# EAGLE design jnz-rev3 (EAGLE 7.6.0)
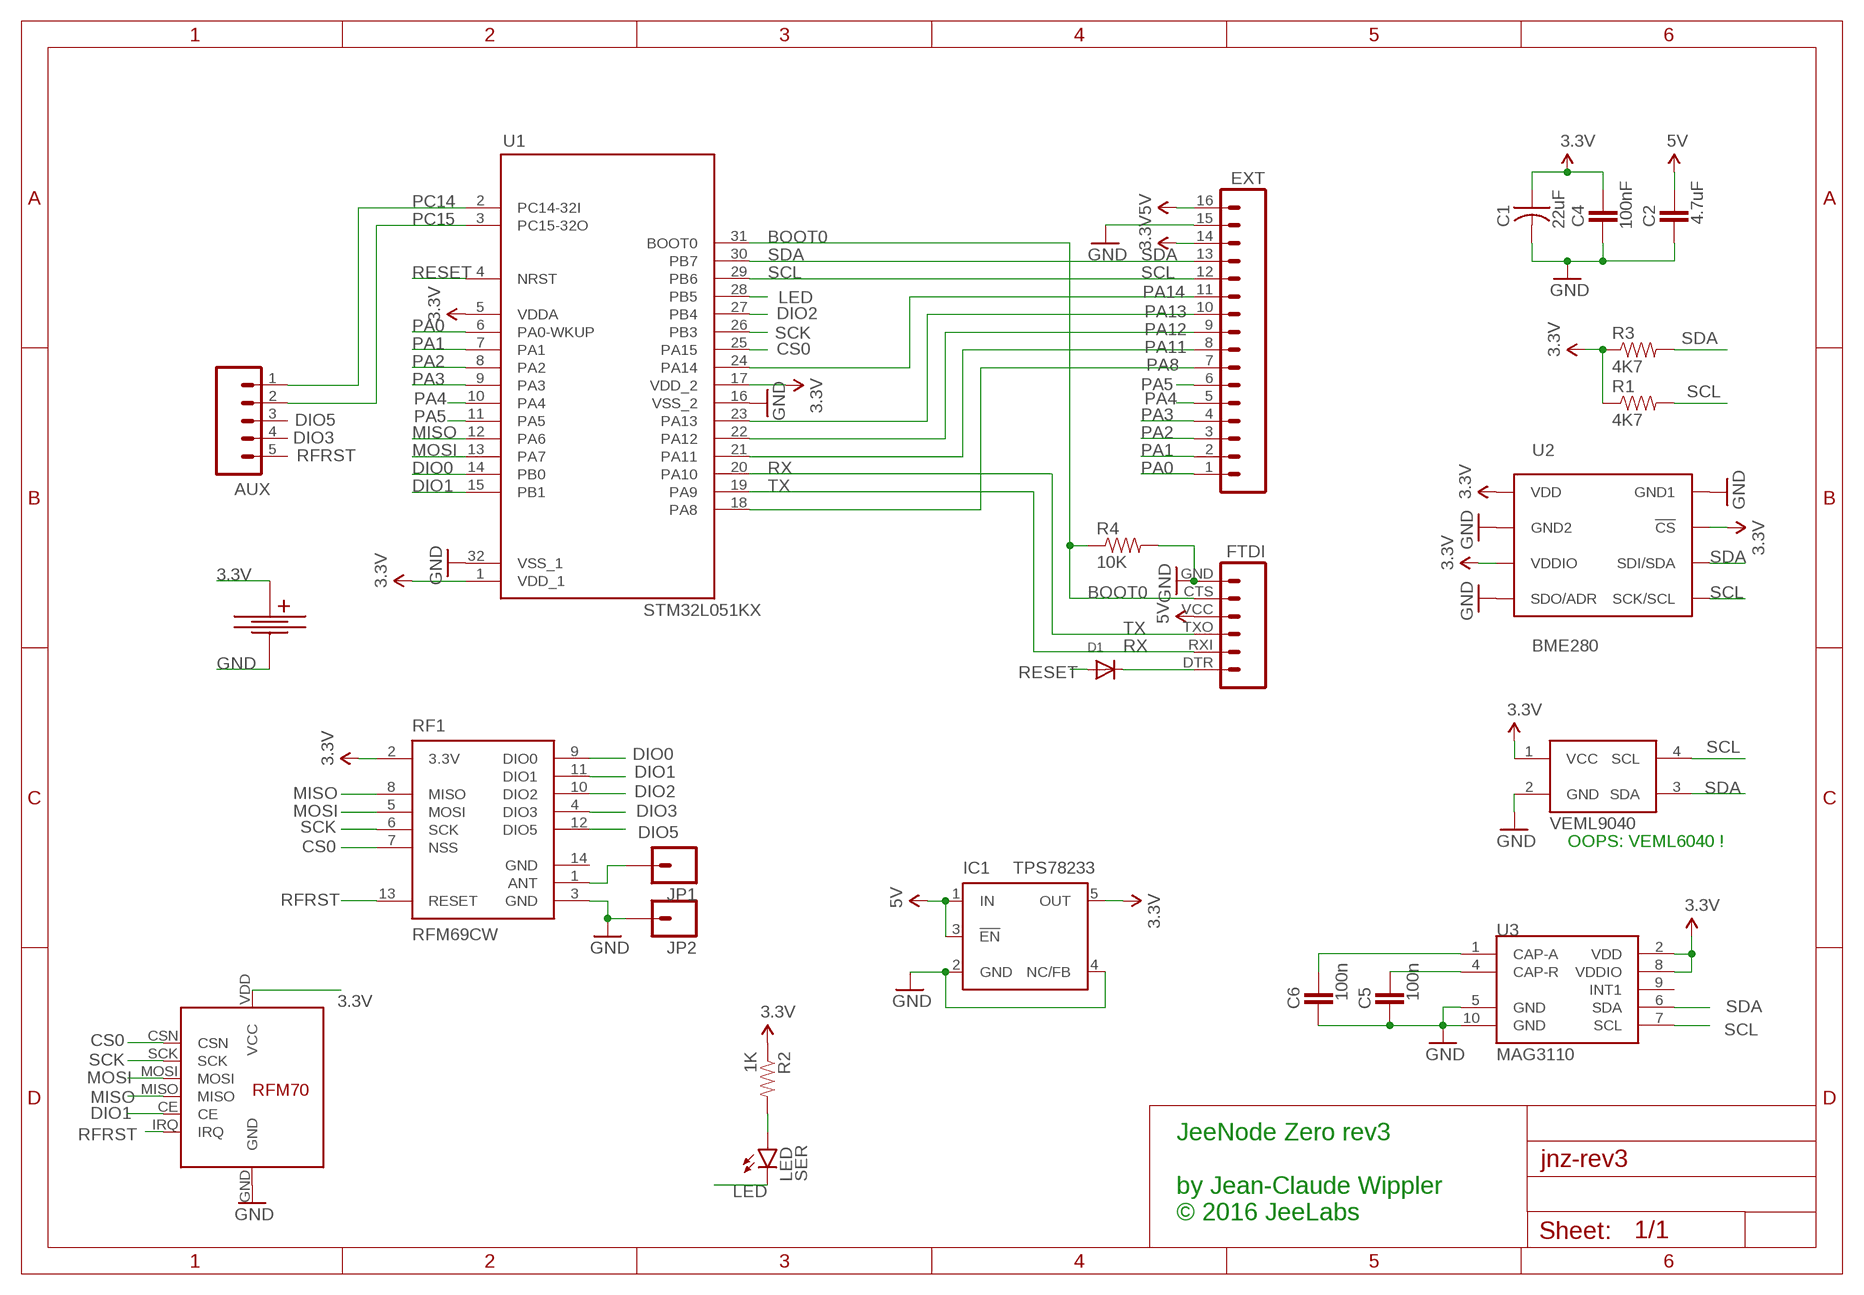
[diagram p0: schematic, sheet 1]

## Parts
AUX  M05NO_SILK  [1X05_NO_SILK]
C1  22uF  C-USC0805  [C0805]
C2  4.7uF  C-EUC0805K  [C0805K]
C4  100nF  C-EUC0603K  [C0603K]
C5  100n  C-EUC0603K  [C0603K]
C6  100n  C-EUC0603K  [C0603K]
D1  DIODESOD-323F  [SOD-323F]
EXT  M161X16_NO_SILK  [1X16_NO_SILK]
FTDI  FTDI_BASICPTH  [FTDI_BASIC]
IC1  TPS78233  TPS77001  [SOT23-DBV]
JP1  M01NOSILK-KIT  [1X01NS-KIT]
JP2  M01NOSILK-KIT  [1X01NS-KIT]
LED  SER  LED0603  [LED-0603]
R1  4K7  RESISTOR0603-RES  [0603-RES]
R2  1K  RESISTOR0603-RES  [0603-RES]
R3  4K7  RESISTOR0603-RES  [0603-RES]
R4  10K  RESISTOR0603-RES  [0603-RES]
RF1  RFM69CW  [RFM69CW-XXXS2]
RF2  RFM7x  RFM70  [RFM70]
U1  STM32L051KX  [TQFP32-08]
U2  BME280  [BME280_LGA]
U3  MAG3110  [DFN-10]
U$2  CR2032-SMD  [CR2032-SMD]
U$3  VEML6040  [OPLGA-4]

## Nets
3.3V [power]: C1.1 C4.1 EXT.14 IC1.5(OUT) R1.1 R2.1 R3.1 RF1.2(3.3V) RF2.VDD(VCC) U1.1(VDD_1) U1.5(VDDA) U1.17(VDD_2) U2.P$2(!CS) U2.P$6(VDDIO) U2.P$8(VDD) U3.2(VDD) U3.8(VDDIO) U$2.POS(+) U$3.1(VCC)
5V [power]: C2.1 EXT.16 FTDI.VCC IC1.1(IN) IC1.3(!EN)
BOOT0: FTDI.CTS R4.1 U1.31(BOOT0)
CS0: RF1.7(NSS) RF2.CSN U1.25(PA15)
DIO0: RF1.9(DIO0) U1.14(PB0)
DIO1: RF1.11(DIO1) RF2.CE U1.15(PB1)
DIO2: RF1.10(DIO2) U1.27(PB4)
DIO3: AUX.4 RF1.4(DIO3)
DIO5: AUX.3 RF1.12(DIO5)
GND: C1.2 C2.2 C4.2 C5.2 C6.2 EXT.15 FTDI.GND IC1.2(GND) IC1.4(NC/FB) JP2.1 R4.2 RF1.3(GND) RF2.GND U1.16(VSS_2) U1.32(VSS_1) U2.P$1(GND1) U2.P$5(SDO/ADR) U2.P$7(GND2) U3.5(GND) U3.10(GND) U$2.NEG(-) U$3.2(GND)
LED: LED.C U1.28(PB5)
MISO: RF1.8(MISO) RF2.MISO U1.12(PA6)
MOSI: RF1.5(MOSI) RF2.MOSI U1.13(PA7)
N$1: D1.C FTDI.DTR
N$2: LED.A R2.2
N$4: C5.1 U3.4(CAP-R)
N$5: C6.1 U3.1(CAP-A)
N$13: JP1.1 RF1.1(ANT)
PA0: EXT.1 U1.6(PA0-WKUP)
PA1: EXT.2 U1.7(PA1)
PA2: EXT.3 U1.8(PA2)
PA3: EXT.4 U1.9(PA3)
PA4: EXT.5 U1.10(PA4)
PA5: EXT.6 U1.11(PA5)
PA8: EXT.7 U1.18(PA8)
PA11: EXT.8 U1.21(PA11)
PA12: EXT.9 U1.22(PA12)
PA13: EXT.10 U1.23(PA13)
PA14: EXT.11 U1.24(PA14)
PC14: AUX.1 U1.2(PC14-32I)
PC15: AUX.2 U1.3(PC15-32O)
RESET: D1.A U1.4(NRST)
RFRST: AUX.5 RF1.13(RESET) RF2.IRQ
RX: FTDI.TXO U1.20(PA10)
SCK: RF1.6(SCK) RF2.SCK U1.26(PB3)
SCL: EXT.12 R1.2 U1.29(PB6) U2.P$4(SCK/SCL) U3.7(SCL) U$3.4(SCL)
SDA: EXT.13 R3.2 U1.30(PB7) U2.P$3(SDI/SDA) U3.6(SDA) U$3.3(SDA)
TX: FTDI.RXI U1.19(PA9)
Unconnected: U3.9(INT1)

## Notes on the sheet
- OOPS: VEML6040 !
- JeeNode Zero rev3
  
  by Jean-Claude Wippler
  © 2016 JeeLabs

## Power pins joined to a net without a drawn wire
GND: RF1.14(GND)

## Library data of the parts
AUX = SparkFun-Connectors:M05: Header 5 Standard 5-pin 0.1" header. Use with straight break away headers (SKU : PRT-00116), right angle break away headers (PRT-00553), swiss pins (PRT-00743), machine pins (PRT-00117), and female headers (PRT-00115). Molex polarized connector foot print use with SKU : PRT-08230 with associated crimp pins and housings.
C1 = resistor:C-US: CAPACITOR, American symbol
C2 C4-C6 = rcl:C-EU: CAPACITOR, European symbol
D1 = adafruit:DIODE: Diode SMADIODE - SMA Surface Mount Package 20V 1A Schottky Diode Digikey: 641-1014-6-ND DO-1N4148 - Through Hole Small Current Diode SOD-123 20V 1 A (.5mV Vf) Schottky Diode - Digikey: MBRX120TPMSCT-ND SOD-323 10V 570mA (.38mV Vf, 3ns) Schottky Diode - Digikey: ZLLS410CT-ND SOD-523 30V 30mA Schottky Diode (RB751S-40TE61) - Digikey: RB751S-40TE61CT-ND SOT23-R/W - SOT23 Package (R = Solder Paste/Reflow Ovens, W = Hand-Soldering) BAT54Film 40V 300mA - Digikey: 497-7162-1-ND
EXT = SparkFun-Connectors:M16: 1x16 .1" header
FTDI = SparkFun-Connectors:FTDI_BASIC: FTDI Basic header with labels
IC1 = texas:TPS770*: ULTRALOW-POWER 50-mA LOW-DROPOUT LINEAR REGULATORS 50-mA Low-Dropout Regulator Source: http://focus.ti.com/lit/ds/symlink/tps77001.pdf; MF: TEXAS INSTRUMENTS; MPN: TPS77001DBVT; OC_FARNELL: 8461554; OC_NEWARK: 77C1171
JP1 JP2 = SparkFun-Connectors:M01: Header 1 Standard 1-pin 0.1" header. Use with straight break away headers (SKU : PRT-00116), right angle break away headers (PRT-00553), swiss pins (PRT-00743), machine pins (PRT-00117), and female headers (PRT-00115).
LED = SparkFun-LED:LED: LEDs Standard schematic elements and footprints for 5mm, 3mm, 1206, and 0603 sized LEDs. 5mm - Spark Fun Electronics SKU : COM-00529 (and others)
R1-R4 = SparkFun-Passives:RESISTOR: Resistor Basic schematic elements and footprints for 0603, 1206, and PTH resistors.
RF1 = SparkFun-RF:RFM69
RF2 = JeeLabs:RFM70
U1 = JeeLabs:STM32L051KX
U2 = BME280ComponentLibrary:BME280; PROD_ID: IC-13090
U3 = SparkFun-Sensors:MAG3110: 3-axis digital (I2C) magnetometer
U$2 = tve-parts:CR2032-SMD
U$3 = JeeLabs:VEML6040

## Net classes
1 power: width 0.203 mm

## Board
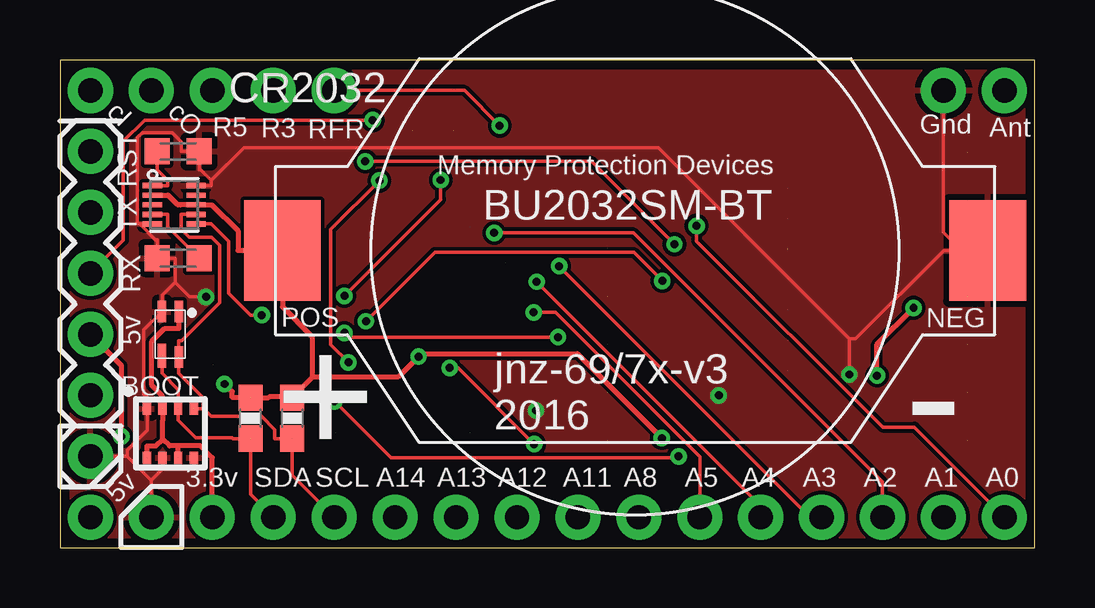
[diagram p1: board, top side]
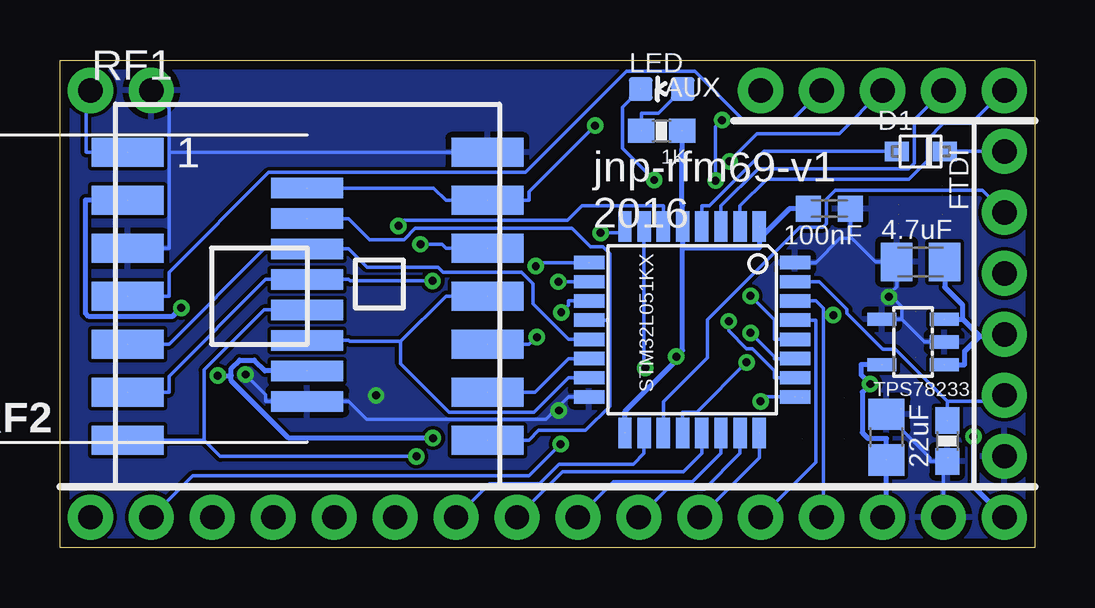
[diagram p2: board, bottom side, seen from below]

Size 40.64 x 20.32 mm. Coordinates in mm from the lower left corner, seen from the top.
Outline: 0,0 40.64,0 40.64,20.32 0,20.32 0,0
Copper layers (1*16): Top 0.0356mm / dielectric 1.5011mm / Bottom 0.0356mm
Design rules "ComboDRU *": minimum track width 6mil, minimum drill 13mil, track to track 6mil, track to pad 6mil, pad to pad 6mil, via to via 6mil, smd to smd 6mil, copper to edge 15mil, drill to drill 10mil, minimum pad ring 10mil, minimum via ring 7mil, stop-mask expansion 3mil, vias tented up to drill 20mil, thermal gap 10mil

### Footprints (pad centres in the part's own frame; a part is rotated, then mirrored left to right if it is on the bottom)
1X05_NO_SILK = drill 1.016 pad 1.88: 1 0,0; 2 2.54,0; 3 5.08,0; 4 7.62,0; 5 10.16,0
C0805 = smd 1.3 x 1.5: 1 -0.95,0; 2 0.95,0
C0805K = smd 1.3 x 1.6: 1 -1,0; 2 1,0
C0603K = smd 1.05 x 1.08: 1 -0.875,0; 2 0.875,0
SOD-323F = smd 1 x 0.8: A -1,0; C 1,0
1X16_NO_SILK = drill 1.016 pad 1.88: 1 0,0; 2 2.54,0; 3 5.08,0; 4 7.62,0; 5 10.16,0; 6 12.7,0; 7 15.24,0; 8 17.78,0; 9 20.32,0; 10 22.86,0; 11 25.4,0; 12 27.94,0; 13 30.48,0; 14 33.02,0; 15 35.56,0; 16 38.1,0
FTDI_BASIC = drill 1.016 pad 1.88: CTS 10.16,0; DTR 0,0; GND 12.7,0; RXI 2.54,0; TXO 5.08,0; VCC 7.62,0
SOT23-DBV = smd 0.55 x 1.2: 1 -0.95,-1.3; 2 0,-1.3; 3 0.95,-1.3; 4 0.95,1.3; 5 -0.95,1.3
1X01NS-KIT = drill 1.016 pad 1.88: 1 0,0
LED-0603 = smd 1 x 1: A 0,-0.877; C 0,0.877
0603-RES = smd 1.1 x 1: 1 -0.85,0; 2 0.85,0
RFM69CW-XXXS2 = smd 3 x 1.2: 1 -7.5,6; 2 -7.5,4; 3 -7.5,2; 4 -7.5,0; 5 -7.5,-2; 6 -7.5,-4; 7 -7.5,-6; 8 7.5,-6; 9 7.5,-4; 10 7.5,-2; 11 7.5,0; 12 7.5,2; 13 7.5,4; 14 7.5,6
RFM70 = smd 3 x 0.85: CE -8.4,2.16; CSN -8.4,0.89; GND -8.4,4.7; IRQ -8.4,-4.19; MISO -8.4,-2.92; MOSI -8.4,-1.65; SCK -8.4,-0.38; VDD -8.4,3.43
TQFP32-08 = smd 1.27 x 0.559: 1 -4.293,2.8; 2 -4.293,2; 3 -4.293,1.2; 4 -4.293,0.4; 5 -4.293,-0.4; 6 -4.293,-1.2; 7 -4.293,-2; 8 -4.293,-2.8; 17 4.293,-2.8; 18 4.293,-2; 19 4.293,-1.2; 20 4.293,-0.4; 21 4.293,0.4; 22 4.293,1.2; 23 4.293,2; 24 4.293,2.8 | smd 0.559 x 1.27: 9 -2.8,-4.293; 10 -2,-4.293; 11 -1.2,-4.293; 12 -0.4,-4.293; 13 0.4,-4.293; 14 1.2,-4.293; 15 2,-4.293; 16 2.8,-4.293; 25 2.8,4.293; 26 2,4.293; 27 1.2,4.293; 28 0.4,4.293; 29 -0.4,4.293; 30 -1.2,4.293; 31 -2,4.293; 32 -2.8,4.293
BME280_LGA = smd 0.5 x 0.35: P$1 1.025,0.975; P$2 1.025,0.325; P$3 1.025,-0.325; P$4 1.025,-0.975; P$5 -1.025,-0.975; P$6 -1.025,-0.325; P$7 -1.025,0.325; P$8 -1.025,0.975
DFN-10 = smd 0.8 x 0.22: 1 -0.91,0.8; 2 -0.91,0.4; 3 -0.91,0; 4 -0.91,-0.4; 5 -0.91,-0.8; 6 0.91,-0.8; 7 0.91,-0.4; 8 0.91,0; 9 0.91,0.4; 10 0.91,0.8
CR2032-SMD = smd 3.2 x 4.2: NEG 14.7,0; POS -14.7,0
OPLGA-4 = smd 0.9 x 0.35: 1 -0.95,0.35; 2 -0.95,-0.35; 4 0.95,0.35 | smd 1 x 0.35: 3 0.9,-0.35

### Placement (x,y rotation side)
AUX  1.27,19.05 0 top
C1  6.19,4.6 90 bottom
C2  4.76,11.91 180 bottom
C4  8.57,14.13 0 bottom
C5  4.92,12.07 180 top
C6  4.92,16.51 0 top
D1  4.76,16.51 0 bottom
EXT  39.37,1.27 180 top
FTDI  1.27,16.51 270 top
IC1  5.08,8.57 90 bottom
JP1  39.37,19.05 0 top
JP2  36.83,19.05 0 top
LED  15.56,19.11 90 bottom
R1  9.68,5.4 270 top
R2  15.56,17.37 180 bottom
R3  7.94,5.4 270 top
R4  3.65,4.45 270 bottom
RF1  30.32,10.48 0 bottom
RF2  38.73,10.79 180 bottom
U1  14.29,9.08 270 bottom
U2  4.6,4.76 90 top
U3  4.76,14.29 0 top
U$2  23.97,12.38 0 top
U$3  4.6,8.89 270 top

### Tracks (layer width: path | path; a pad name or v marks a point on that pad's centre or on a via)
3.3V  (via drill 0.33 pad 0.69)  (15 unrouted)
  Top 0.203: v25.09,4.57 21.57,8.09 15.07,8.09 v14.95,7.96 14.11,7.13 10.53,7.13 | 9.68,6.29 10.53,7.13 | 10.53,7.13 10.53,8.78 9.27,10.03 U$2.POS 7.42,12.38 7.42,13.2 6.33,14.29 U3.8 5.35,14.29 5.02,14.29 4.91,14.29 4.51,14.69 U3.2 | 9.68,6.29 8.73,6.29 8.69,6.25 R3.1 7.18,6.25 7.18,6.5 v6.86,6.82 | v34.06,7.17 34.06,8.47 v35.58,10 | R1.1 9.68,6.29 | 4.93,4.24 4.56,4.24 4.28,4.53 | U2.P$6 4.93,4.24 | EXT.14 6.35,3.75 5.86,4.24 4.93,4.24 | 4.28,4.53 4.28,5.28 U2.P$2 4.28,6.31 3.82,6.76 3.82,8.6 4.37,9.14 4.95,9.14 U$3.1 | 4.28,4.53 4,4.24 3.63,4.24 U2.P$8
  Bottom 0.203: 33.5,7.17 33.5,7.47 33.16,7.81 32.54,7.81 32.09,7.37 RF2.VDD | v34.06,7.17 33.5,7.17 | v25.09,4.57 31.11,4.57 33.5,6.96 33.5,7.17 | U1.17 17.09,5.68 14.95,7.82 v14.95,7.96 14.69,8.22 14.69,12.48 | RF1.2 39.57,14.48 39.57,9.76 39.44,9.62 35.96,9.62 v35.58,10 | EXT.14 6.19,1.43 C1.1 6.19,4.56 6.96,4.56 7.2,4.8 7.2,6.49 v6.86,6.82 7.23,7.19 7.23,7.62 IC1.5 | C4.1 10.23,14.13 11.39,12.96 11.49,12.96 | 11.49,12.96 11.49,12.48 14.69,12.48 | U1.1 11.49,12.96 | 14.69,12.48 U1.5 14.69,14.26 14.71,14.28 14.71,16.61 R2.1
5V  (via drill 0.33 pad 0.69)  (2 unrouted)
  Top 0.203: FTDI.VCC 2.56,7.6 v2.56,4.63
  Bottom 0.203: 2.31,8.81 1.35,8.81 FTDI.VCC | 3.02,9.52 2.31,8.81 | 2.31,8.81 2.93,8.19 2.93,7.62 IC1.1 | 3.02,9.52 3.02,10.11 3.76,10.85 C2.1 | v2.56,4.63 2.56,2.56 EXT.16 | IC1.3 3.02,9.52
BOOT0  (1 unrouted)
  Bottom 0.152: 3.65,6.09 5.83,8.27 6.33,8.27 7.84,9.78 7.84,9.92 8.99,11.08 9.13,11.08 U1.31 | 3.65,6.09 R4.1 | 3.65,6.09 1.53,6.09 FTDI.CTS
CS0  (via drill 0.33 pad 0.69)  (3 unrouted)
  Top 0.152: v11.44,6.1 13.8,3.74 25.72,3.74 v25.78,3.8
  Bottom 0.152: 34.63,4.48 36.09,4.48 RF1.7 | 34.63,4.48 34.63,7.41 32.13,9.91 32.06,9.91 RF2.CSN | v25.78,3.8 33.96,3.8 34.63,4.48 | U1.25 11.26,6.28 v11.44,6.1
DIO0  (1 unrouted)
  Bottom 0.152: U1.14 19.44,7.88 20.85,6.48 21.09,6.48 RF1.9
DIO1  (2 unrouted)
  Bottom 0.152: 26.43,8.59 24.55,10.48 RF1.11 | 26.43,8.59 26.43,7.67 24.42,5.65 20.88,5.65 19.44,7.08 U1.15 | 26.43,8.59 28.57,8.59 28.61,8.63 RF2.CE
DIO2  (via drill 0.33 pad 0.69)  (1 unrouted)
  Top 0.152: v11.86,8.95 12.03,8.77 v20.76,8.77
  Bottom 0.152: U1.27 10.86,7.88 10.86,7.95 v11.86,8.95 | RF1.10 21.09,8.48 20.8,8.77 v20.76,8.77
DIO3  (1 unrouted)
  Bottom 0.152: AUX.4 10.06,17.88 12.21,17.88 14.17,19.84 17.03,19.84 21.23,15.64 31.94,15.64 36.09,11.48 36.09,10.48 RF1.4
DIO5  (via drill 0.33 pad 0.69)  (1 unrouted)
  Top 0.152: v25.62,12.64 22.16,16.1 v12.72,16.1
  Bottom 0.152: RF1.12 24.55,12.48 24.71,12.64 v25.62,12.64 | v12.72,16.1 11.58,17.24 8.16,17.24 AUX.3
GND  (via drill 0.33 pad 0.69)
  Top 0.152: 2.8,3.82 2.8,4.06 3.63,4.89 3.63,5.31 U2.P$1 3.63,6.27 3.49,6.4 3.49,9.08 U$3.2 4.25,10.52 4.8,11.06 | 3.81,2.81 2.8,3.82 | FTDI.GND 2.8,3.82 | v6.09,10.45 5.41,10.45 4.8,11.06 | 4.8,11.06 4.8,12.07 C5.2 4.05,12.83 3.97,12.83 3.31,13.49 | 6.3,15.3 5.86,15.74 5.8,15.74 C6.2 5.04,16.51 5.04,16.91 4.67,17.28 3.43,17.28 3.22,17.08 3.22,13.49 3.31,13.49 | 6.3,15.3 6.3,15.09 U3.10 | 6.3,15.3 7.67,16.67 24.94,16.67 32.91,8.7 | 32.91,8.7 v32.91,7.22 | 32.91,8.7 33.16,8.7 36.84,12.38 37.6,12.38 | 37.6,12.38 36.83,13.15 JP2.1 | U$2.NEG 37.6,12.38 | U2.P$5 5.58,3.26 4.28,3.26 | 3.81,2.81 4.26,3.26 4.28,3.26 | U3.5 3.31,13.49 | EXT.15 3.81,2.81 | U2.P$7 4.28,3.26
  Bottom 0.152: 4.11,3.6 3.81,3.29 EXT.15 | 4.11,3.6 4.38,3.6 4.38,3.74 C1.2 | R4.2 4.11,3.6 | v32.91,7.22 32.06,6.37 32.06,6.1 RF2.GND 28.61,6.1 27.86,5.34 20.38,5.34 19.44,6.28 U1.16 | 5.55,9.52 4.61,8.58 4.61,8.57 IC1.2 | 5.55,9.52 5.55,10.04 5.96,10.45 | 5.96,10.45 5.96,10.68 5.76,10.88 C2.2 6.64,11.91 7.63,12.89 7.7,12.89 | v6.09,10.45 5.96,10.45 | 36.09,16.48 36.09,18.31 JP2.1 | 36.09,16.48 36.09,12.48 RF1.3 | 36.09,16.48 24.55,16.48 RF1.14 | 7.7,12.89 8.12,12.89 9.13,11.88 U1.32 | 7.7,12.89 C4.2 | IC1.4 5.55,9.52
  other vias: 27.46,6.35 19.84,5.71
  pour Bottom: -1.27,-2.54 -1.27,22.86 41.91,22.86 41.91,-2.54
  pour Top: -2.54,-1.27 -2.54,21.59 43.18,21.59 43.18,-1.27
LED  (via drill 0.33 pad 0.69)  (1 unrouted)
  Top 0.152: v11.86,10.49 15.87,14.5 v15.87,15.32
  Bottom 0.152: U1.28 10.86,8.68 10.86,9.49 v11.86,10.49 | v15.87,15.32 17.19,16.64 17.19,18.36 LED.C
MISO  (2 unrouted)
  Bottom 0.152: 17.72,9.48 17.72,12.26 18.01,12.54 18.54,12.54 19.3,13.31 25.83,13.31 26.3,12.84 27.73,12.84 28.61,13.71 RF2.MISO | 17.72,9.48 17.72,5.9 18.73,4.89 20.68,4.89 21.09,4.48 RF1.8 | U1.12 17.72,9.48
MOSI  (2 unrouted)
  Bottom 0.152: U1.13 19.44,8.68 20.92,10.16 20.92,11 21.4,11.48 24.67,11.48 24.87,11.69 27.85,11.69 28.61,12.45 RF2.MOSI 32.12,12.45 36.09,8.48 RF1.5
N$1
  Bottom 0.152: FTDI.DTR D1.C
N$2  (2 unrouted)
  Bottom 0.152: R2.2 16.41,18.1 15.7,18.1 LED.A
N$4  (1 unrouted)
  Top 0.152: U3.4 4.48,13.89 4.48,13.38 C5.1
N$5  (1 unrouted)
  Top 0.152: C6.1 4.05,15.74 4.48,15.31 4.48,15.09 U3.1
N$13  (1 unrouted)
  Bottom 0.152: RF1.1 39.55,16.48 39.55,18.87 JP1.1
PA0  (via drill 0.33 pad 0.69)
  Top 0.152: v26.53,13.41 26.53,12.78 34.29,5.02 35.62,5.02 EXT.1
  Bottom 0.152: U1.6 15.49,14.24 18.89,14.24 19.48,13.65 26.3,13.65 v26.53,13.41
PA1  (via drill 0.33 pad 0.69)
  Top 0.152: v16.24,7.49 16.59,7.49 v19.77,4.31
  Bottom 0.152: v19.77,4.31 21.09,2.99 35.11,2.99 EXT.2 | U1.7 16.29,7.54 v16.24,7.49
PA2  (via drill 0.33 pad 0.69)  (1 unrouted)
  Top 0.152: EXT.3 34.29,2.74 23.91,13.12 v18.1,13.12
  Bottom 0.152: U1.8 17.34,13.12 v18.1,13.12
PA3  (via drill 0.33 pad 0.69)  (1 unrouted)
  Top 0.152: EXT.4 31.27,1.27 v20.81,11.73
  Bottom 0.152: v20.81,11.73 20.66,11.88 19.44,11.88 U1.9
PA4  (via drill 0.33 pad 0.69)
  Top 0.152: v19.87,11.08 29.21,1.74 EXT.5
  Bottom 0.152: U1.10 v19.87,11.08
PA5  (via drill 0.33 pad 0.69)
  Top 0.152: EXT.6 26.67,3.8 20.66,9.8 v19.74,9.8
  Bottom 0.152: U1.11 19.44,10.28 19.44,10.11 v19.74,9.8
PA8
  Bottom 0.152: U1.18 16.29,3.92 16.74,3.48 19.84,3.48 20.65,2.67 22.73,2.67 EXT.7
PA11
  Bottom 0.152: U1.21 13.89,3.92 14.64,3.17 19.69,3.17 EXT.8
PA12
  Bottom 0.152: EXT.9 17.58,2.74 14.27,2.74 13.09,3.92 U1.22
PA13
  Bottom 0.152: U1.23 12.29,3.92 13.77,2.44 15.34,2.44 EXT.10
PA14  (1 unrouted)
  Bottom 0.152: U1.24 11.49,3.75 EXT.11
PC14
  Bottom 0.152: U1.2 12.29,14.24 11.16,15.36 5.26,15.36 4.49,16.12 4.49,17 3.82,17.68 2.64,17.68 AUX.1
PC15
  Bottom 0.152: AUX.2 5.03,17.83 5.03,16.01 5.25,15.8 11.53,15.8 13.09,14.24 U1.3
RESET
  Bottom 0.152: D1.A 11.29,16.51 13.56,14.24 13.89,14.24 U1.4
RFRST  (via drill 0.33 pad 0.69)  (2 unrouted)
  Top 0.152: v18.33,17.59 16.86,19.05 AUX.5
  Bottom 0.152: RF2.IRQ 25.06,14.98 24.55,14.48 RF1.13 21.09,14.48 21.09,14.82 v18.33,17.59
RX  (via drill 0.33 pad 0.69)
  Top 0.152: v13.04,17.81 3.53,17.81 2.64,16.93 2.64,12.8 FTDI.TXO | v12.02,7.72 11.28,8.46 11.28,13.26 v13.32,15.29
  Bottom 0.152: U1.20 14.69,5.65 14.1,5.65 v12.02,7.72 | v13.32,15.29 13.32,17.53 v13.04,17.81
SCK  (via drill 0.33 pad 0.69)  (2 unrouted)
  Top 0.152: v12.76,9.44 15.63,12.3 23.92,12.3 v25.11,11.11
  Bottom 0.152: U1.26 10.86,7.08 10.86,7.37 11.79,8.3 12.02,8.3 12.76,9.04 v12.76,9.44 | v12.76,9.44 | v25.11,11.11 28.55,11.11 28.61,11.18 RF2.SCK 32.06,11.18 36.09,7.15 36.09,6.48 RF1.6
SCL  (4 unrouted)
  Top 0.152: 5.96,5.79 5.96,6.25 4.95,7.26 U$3.4 4.95,8.62 5.07,8.62 6.66,10.21 6.66,12.59 6.32,12.93 5.39,12.93 5.04,13.28 5.04,13.89 U3.7 | 5.96,5.79 5.98,5.79 6.3,5.47 8.4,5.47 8.96,4.91 8.96,4.55 R1.2 9.68,3.77 9.68,3.02 EXT.12 | U2.P$4 5.96,5.79
  Bottom 0.152: U1.29 9.13,9.48 9.13,3.57 EXT.12
SDA  (via drill 0.33 pad 0.69)  (4 unrouted)
  Top 0.152: U3.6 6.3,13.49 7.02,12.77 7.02,10.6 7.94,9.69 v8.41,9.69 | U$3.3 4.25,7.26 4.93,6.59 4.93,6.27 U2.P$3 4.93,5.31 5.67,4.57 7.19,4.57 7.21,4.55 R3.2 7.94,3.77 7.94,2.22 EXT.13
  Bottom 0.152: 8.82,9.69 8.82,9.97 9.13,10.28 U1.30 | EXT.13 8.82,1.34 8.82,9.69 | v8.41,9.69 8.82,9.69
TX
  Bottom 0.152: U1.19 15.49,6.08 13.66,7.92 13.66,9.5 9.8,13.36 8.83,13.36 8.69,13.49 8.69,14.53 8.32,14.9 2.2,14.9 FTDI.RXI

### Text on the board
tNames: cI | RST | cO | Gnd | Ant | R5 | R3 | RFR | TX | RX | 5v | NEG | POS | BOOT | jnz-69/7x-v3 / 2016 | 3.3v | SDA | SCL | A14 | A13 | A12 | A11 | A8 | A5 | A4 | A3 | A2 | A1 | A0 | 5v
bNames: jnp-rfm69-v1 / 2016